# Altium project Shuttler_AMC.PrjPcb (part 15 of 20)

## Sheet IO_Connectors.SchDoc: =ProjectName
size 420 x 297 mm; Author: T.P.; CompanyName: WUT; DrawnBy: T.P.; Organization: WUT ISE; Address1: Warsaw Univeristy of Technology; Address2: Nowowiejska 15/19; DocumentNumber: 36; Revision: 0.9; SheetNumber: 36; SheetTotal: 36; EDA_Number: ARTIQ; Projet: ARTIQ/SINARA; ModifiedBy: -; CreateDate: XX/XX/XXXX; CheckedDate: -; Title2: IO_Connectors.SchDoc; DivGrp: ISE; Designer: G.K. and T.P.
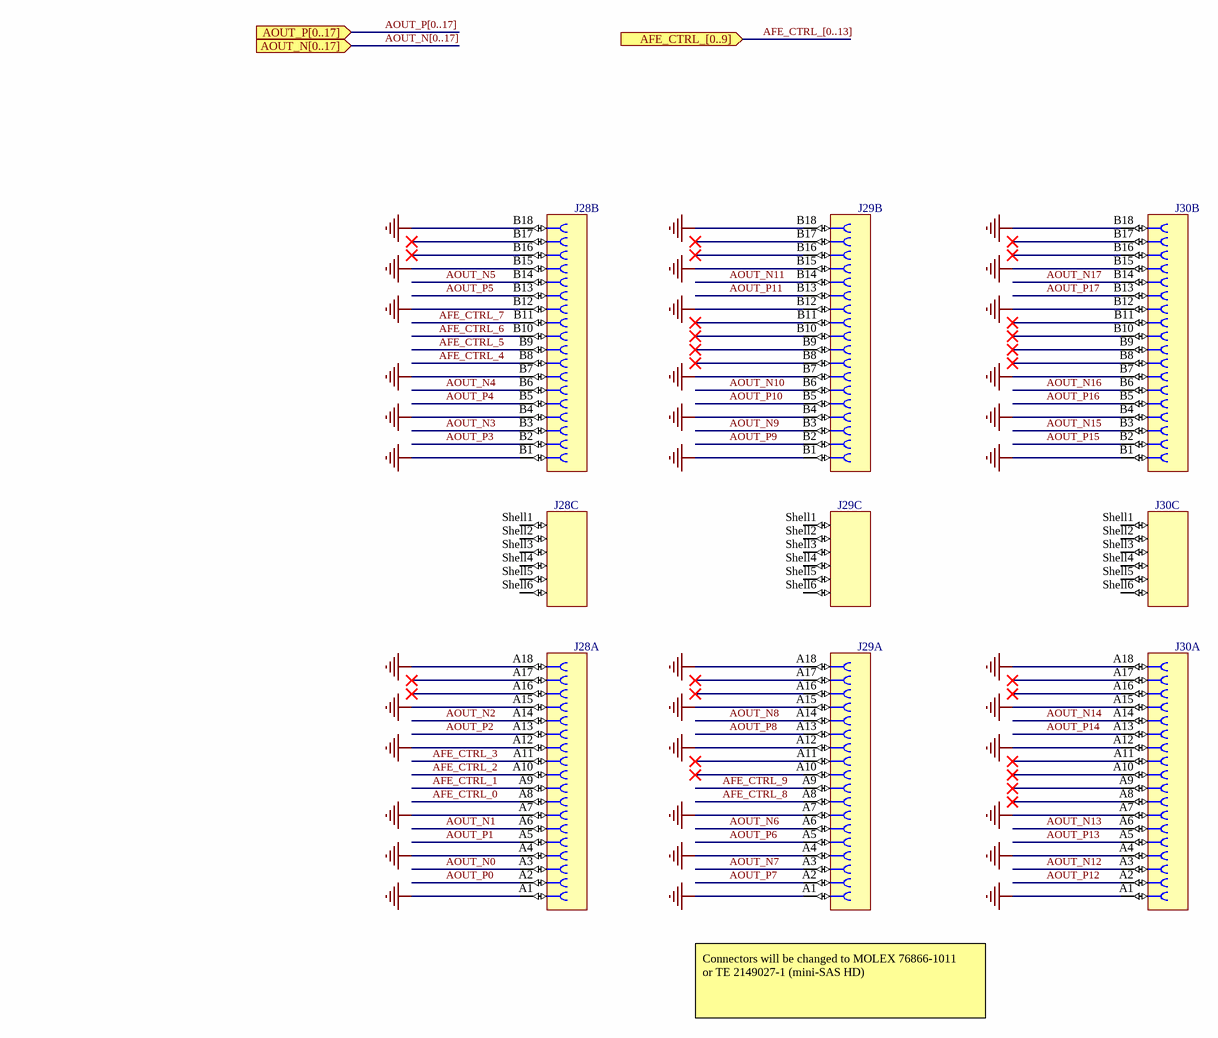
[diagram p26: IO_Connectors.SchDoc]

### Parts
J28  iPass™  [MOLEX_75783-0107]  (value not drawn)  (parts A,B,C of 3)
J29  iPass™  [MOLEX_75783-0107]  (value not drawn)  (parts A,B,C of 3)
J30  iPass™  [MOLEX_75783-0107]  (value not drawn)  (parts A,B,C of 3)

### Ports
AFE_CTRL_[0..9] (in), AOUT_N[0..17] (in), AOUT_P[0..17] (in)

### Nets
GND: J28.A1 J28.A4 J28.A7 J28.A12 J28.A15 J28.A18 J28.B1 J28.B4 J28.B7 J28.B12 J28.B15 J28.B18 J29.A1 J29.A4 J29.A7 J29.A12 J29.A15 J29.A18 J29.B1 J29.B4 J29.B7 J29.B12 J29.B15 J29.B18 J30.A1 J30.A4 J30.A7 J30.A12 J30.A15 J30.A18 J30.B1 J30.B4 J30.B7 J30.B12 J30.B15 J30.B18
AFE_CTRL_0: J28.A8
AFE_CTRL_1: J28.A9
AFE_CTRL_2: J28.A10
AFE_CTRL_3: J28.A11
AFE_CTRL_4: J28.B8
AFE_CTRL_5: J28.B9
AFE_CTRL_6: J28.B10
AFE_CTRL_7: J28.B11
AFE_CTRL_8: J29.A8
AFE_CTRL_9: J29.A9
AOUT_N0: J28.A3
AOUT_N1: J28.A6
AOUT_N2: J28.A14
AOUT_N3: J28.B3
AOUT_N4: J28.B6
AOUT_N5: J28.B14
AOUT_N6: J29.A6
AOUT_N7: J29.A3
AOUT_N8: J29.A14
AOUT_N9: J29.B3
AOUT_N10: J29.B6
AOUT_N11: J29.B14
AOUT_N12: J30.A3
AOUT_N13: J30.A6
AOUT_N14: J30.A14
AOUT_N15: J30.B3
AOUT_N16: J30.B6
AOUT_N17: J30.B14
AOUT_P0: J28.A2
AOUT_P1: J28.A5
AOUT_P2: J28.A13
AOUT_P3: J28.B2
AOUT_P4: J28.B5
AOUT_P5: J28.B13
AOUT_P6: J29.A5
AOUT_P7: J29.A2
AOUT_P8: J29.A13
AOUT_P9: J29.B2
AOUT_P10: J29.B5
AOUT_P11: J29.B13
AOUT_P12: J30.A2
AOUT_P13: J30.A5
AOUT_P14: J30.A13
AOUT_P15: J30.B2
AOUT_P16: J30.B5
AOUT_P17: J30.B13

Not connected (* = marked no-connect by the designer): J28 A16* A17* B16* B17* Shell1 Shell2 Shell3 Shell4 Shell5 Shell6; J29 A10* A11* A16* A17* B8* B9* B10* B11* B16* B17* Shell1 Shell2 Shell3 Shell4 Shell5 Shell6; J30 A8* A9* A10* A11* A16* A17* B8* B9* B10* B11* B16* B17* Shell1 Shell2 Shell3 Shell4 Shell5 Shell6

### Buses and harness runs
bus AFE_CTRL_[0..13] = port AFE_CTRL_[0..9]
bus AOUT_N[0..17] = port AOUT_N[0..17]
bus AOUT_P[0..17] = port AOUT_P[0..17]

### Notes on the sheet
- (near J29) Connectors will be changed to MOLEX 76866-1011
  or TE 2149027-1 (mini-SAS HD)
- Project/Equipment
- Document
- Designer
- Drawn by
- Check.by
- File
- Last Mod.
- Print Date
- Sheet
- Size
- A3
- of
- Rev

### Library data of the parts
J28-J30 = MOLEX_75783-0107: 36 Circuit, Right Angle , Internal Assembly, iPass™ I/O Surface Mount Receptacle with Left Key Shell; Manufacturer: MOLEX; PressFit: No; Part Number: MOLEX_75783-0107; Component Kind: Standard; Component Type: Standard; Pin Count: 42; Family: iPass™; Mounted: Yes; Socket: No; SMD: Yes; Sense: No; Status: None; Part Description: 36 Circuit, Right Angle , Internal Assembly, iPass™ I/O Surface Mount Receptacle with Left Key Shell; Manufacturer Part Number: 75783-0107; ComponentHeight: 8.47mm; HelpURL: \\cern.ch\dfs\Applications\Altium\Datasheets\MOLEX_75783-0107.pdf; Author: CERN DEM JLC; CreateDate: 12.11.2014; LatestRevisionDate: 12.11.2014

## Sheet FPGA_Bank_0_CFG.SchDoc: =ProjectName
size 420 x 297 mm; Author: T.P.; CompanyName: WUT; DrawnBy: T.P.; Organization: WUT ISE; Address1: Warsaw Univeristy of Technology; Address2: Nowowiejska 15/19; DocumentNumber: 4; Revision: 0.9; SheetNumber: 4; SheetTotal: 36; EDA_Number: ARTIQ; Projet: ARTIQ/SINARA; ModifiedBy: -; CreateDate: XX/XX/XXXX; CheckedDate: -; Title2: FPGA_Bank_0_CFG.SchDoc; DivGrp: ISE; Designer: G.K. and T.P.; ModifiedDate: -; ProjectName: ADC/DAC MEZZANINE
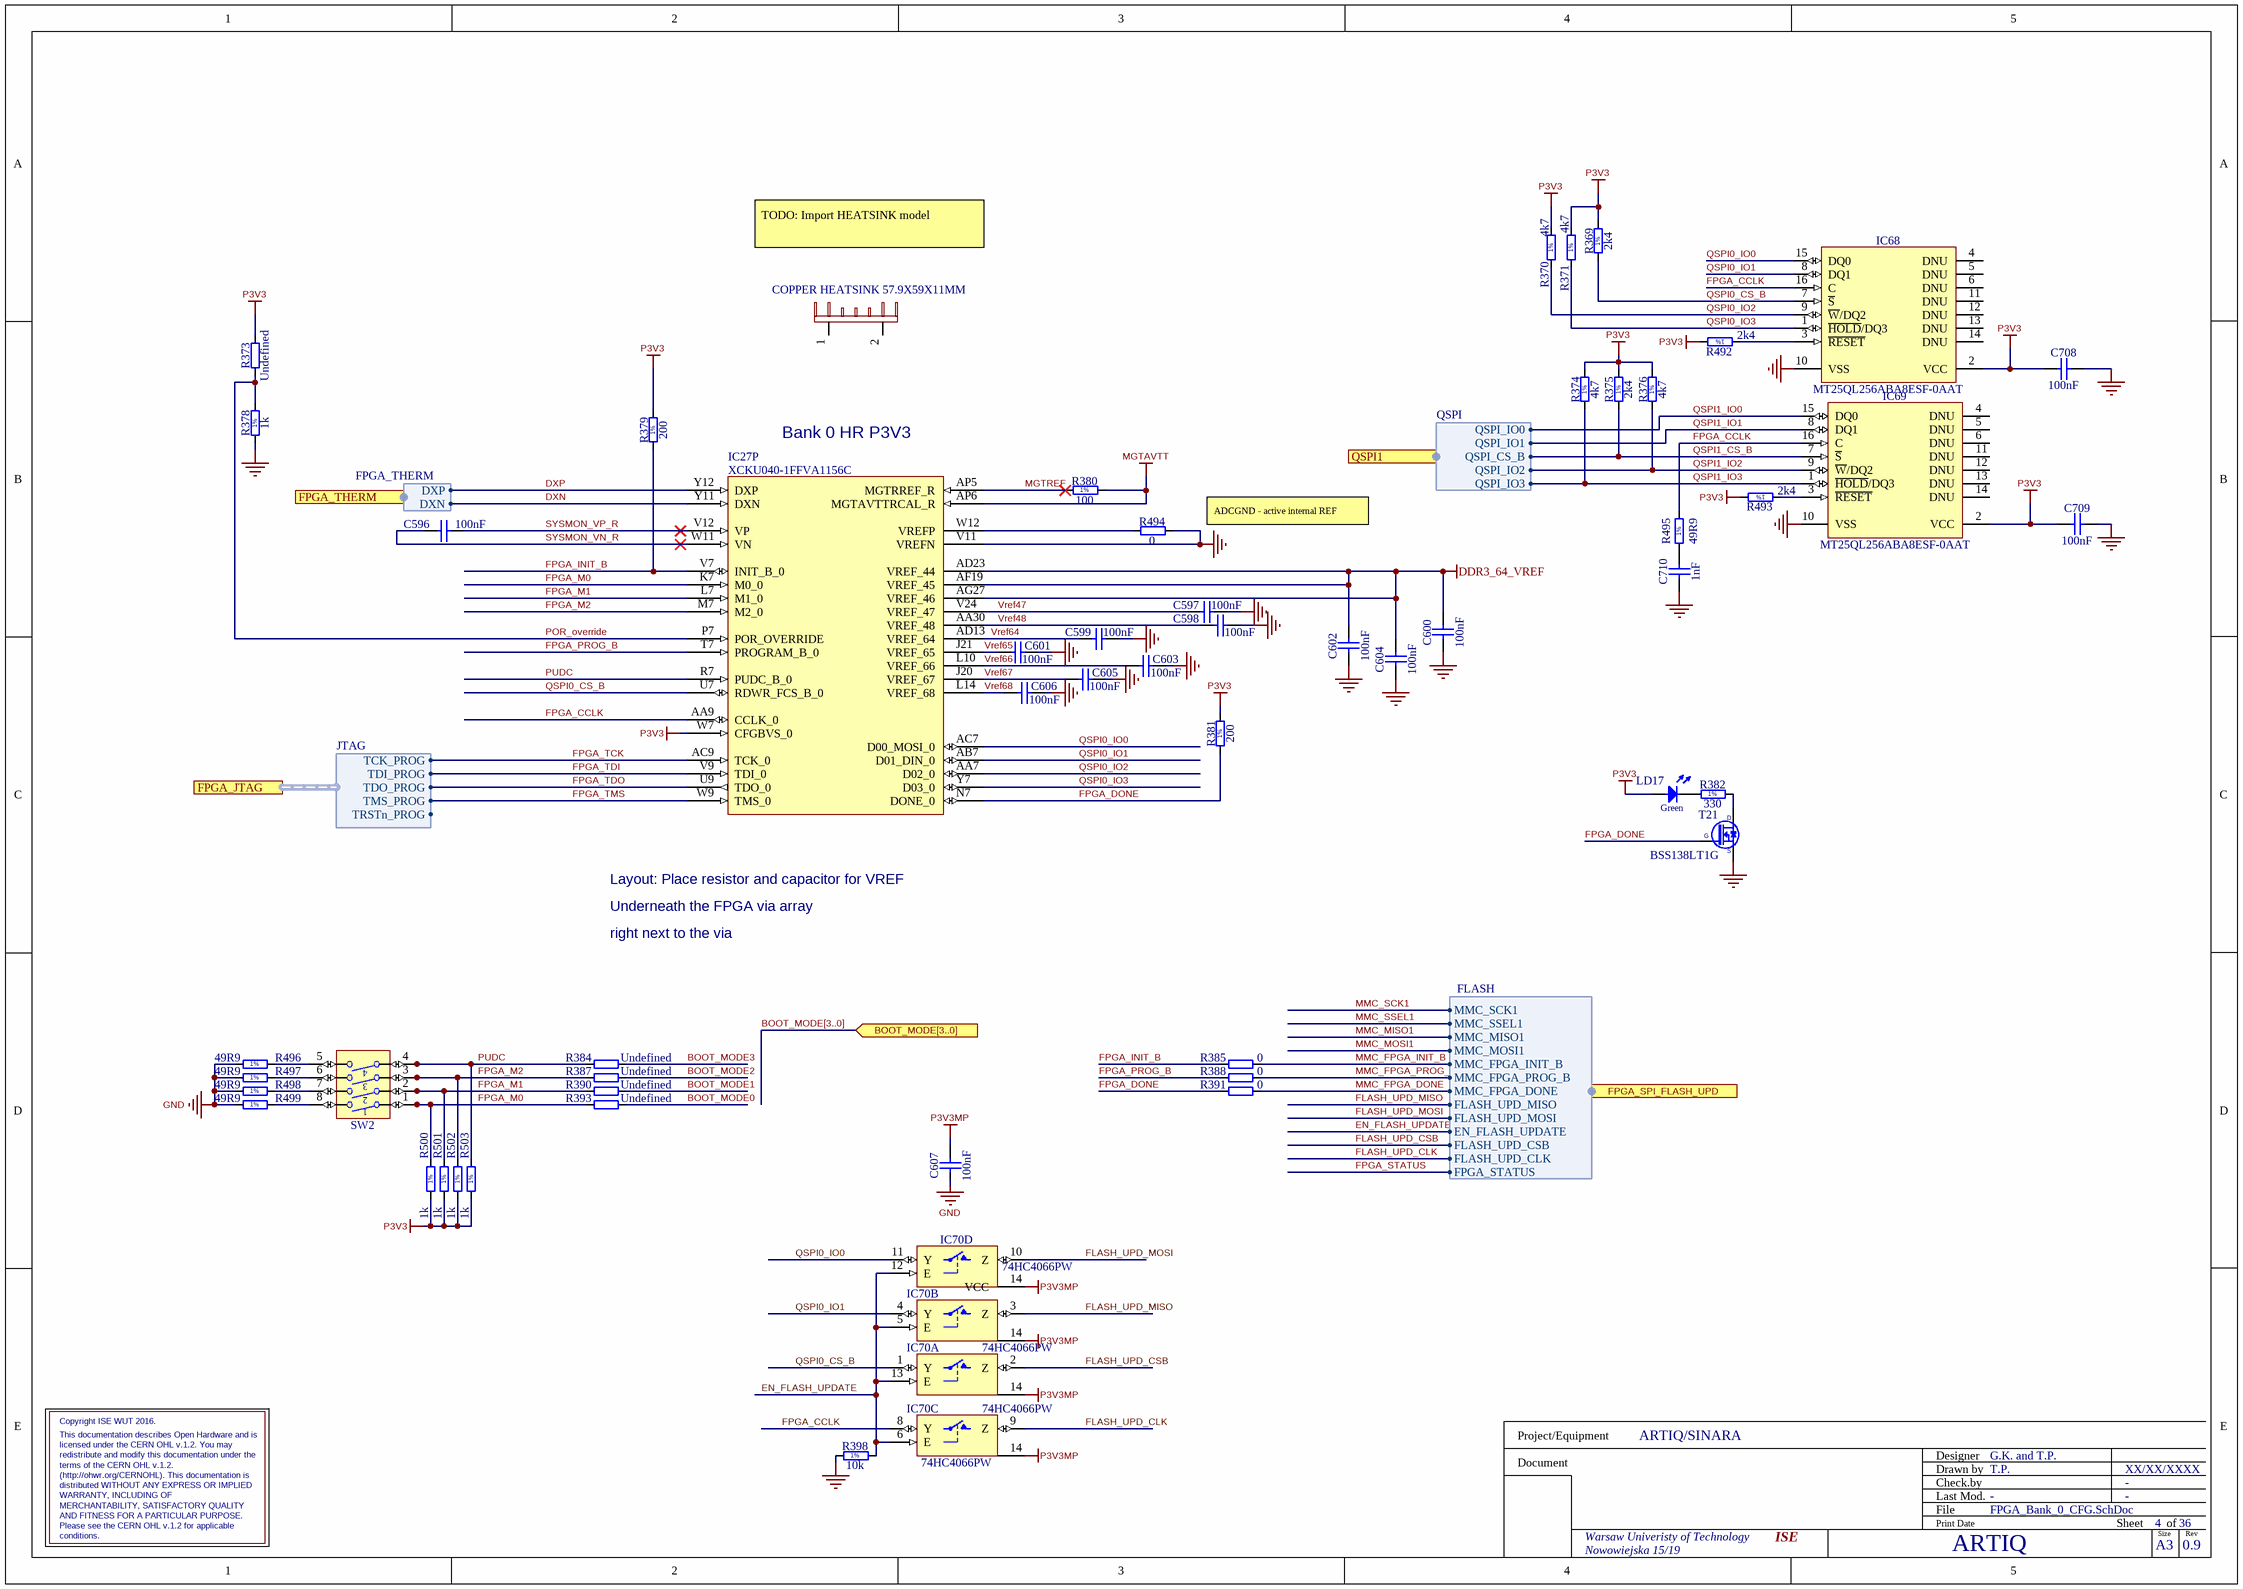
[diagram p27: FPGA_Bank_0_CFG.SchDoc]

### Parts
C596  100nF  [CAPC0603X33N]
C597  100nF  [CAPC0603X33N]
C598  100nF  [CAPC0603X33N]
C599  100nF  [CAPC0603X33N]
C600  100nF  [CAPC0603X33N]
C601  100nF  [CAPC0603X33N]
C602  100nF  [CAPC0603X33N]
C603  100nF  [CAPC0603X33N]
C604  100nF  [CAPC0603X33N]
C605  100nF  [CAPC0603X33N]
C606  100nF  [CAPC0603X33N]
C607  100nF  [CAPC0603X33N]
C708  100nF  [CAPC0603X33N]
C709  100nF  [CAPC0603X33N]
C710  1nF  [CAPC1005X55N]
HS1  Part Description: COPPER HEATSINK 57.9X59X11MM  (hidden comment: 1.9K/W)
IC27  XCKU040-1FFVA1156C  [BGA1156C100P34X34_3500X3500X350]  (part P of 22)
IC68  MT25QL256ABA8ESF-0AAT  [SOIC127P1030X265-16N]
IC69  MT25QL256ABA8ESF-0AAT  [SOIC127P1030X265-16N]
IC70  74HC4066PW  [SOP65P640X110-14N]  (parts A,B,C,D of 4)
LD17  Green  [LED_AVAGO_HSME-C120]
R369  2k4  [RESC1005X40N]
R370  4k7  [RESC1005X40N]
R371  4k7  [RESC1005X40N]
R373  Undefined  [RESC1005X40N]
R374  4k7  [RESC1005X40N]
R375  2k4  [RESC1005X40N]
R376  4k7  [RESC1005X40N]
R378  1k  [RESC1005X40N]
R379  200  [RESC1005X40N]
R380  100  [RESC0603X28N]
R381  200  [RESC1005X40N]
R382  330  [RESC1005X40N]
R384  Undefined  [RESC1005X40N]
R385  0  [RESC1005X40N]
R387  Undefined  [RESC1005X40N]
R388  0  [RESC1005X40N]
R390  Undefined  [RESC1005X40N]
R391  0  [RESC1005X40N]
R393  Undefined  [RESC1005X40N]
R398  10k  [RESC1005X40N]
R492  2k4  [RESC1005X40N]
R493  2k4  [RESC1005X40N]
R494  0  [RESC1005X40N]
R495  49R9  [RESC1005X40N]
R496  49R9  [RESC1005X40N]
R497  49R9  [RESC1005X40N]
R498  49R9  [RESC1005X40N]
R499  49R9  [RESC1005X40N]
R500  1k  [RESC1005X40N]
R501  1k  [RESC1005X40N]
R502  1k  [RESC1005X40N]
R503  1k  [RESC1005X40N]
SW2  Switch  [SW_TYCO_1571983-4]  (value not drawn)
T21  BSS138LT1G  [SOT95P240X110-3N]

### Ports
BOOT_MODE[3..0] (in), FPGA_JTAG (harness JTAG), FPGA_SPI_FLASH_UPD (harness FLASH), FPGA_THERM (harness FPGA_THERM), QSPI1 (harness QSPI)

### Harnesses
JTAG: TDO_PROG, TDI_PROG, TCK_PROG, TMS_PROG, TRSTn_PROG
FPGA_THERM: DXN, DXP
FLASH: MMC_SCK1, MMC_SSEL1, MMC_MISO1, MMC_MOSI1, MMC_FPGA_INIT_B, MMC_FPGA_PROG_B, MMC_FPGA_DONE, FLASH_UPD_MISO, FLASH_UPD_MOSI, EN_FLASH_UPDATE, FLASH_UPD_CSB, FLASH_UPD_CLK, FPGA_STATUS
QSPI: QSPI_IO1, QSPI_IO2, QSPI_IO3, QSPI_IO0, QSPI_CS_B

### Nets
DDR3_64_VREF: C600.1 C602.1 C604.1 IC27.AD23(VREF_44) IC27.AF19(VREF_45) IC27.AG27(VREF_46)
GND: C597.2 C598.2 C599.2 C600.2 C601.2 C602.2 C603.2 C604.2 C605.2 C606.2 C607.1 C708.1 C709.1 C710.1 IC27.V11(VREFN) IC68.10(VSS) IC69.10(VSS) IC70.7(GND) R378.1 R398.1 R494.2 R496.1 R497.1 R498.1 R499.1 T21.2(S)
MGTAVTT: IC27.AP6(MGTAVTTRCAL_R) R380.2
P3V3: C708.2 C709.2 IC27.W7(CFGBVS_0) IC68.2(VCC) IC69.2(VCC) LD17.2(A) R369.2 R370.2 R371.2 R373.2 R374.2 R375.2 R376.2 R379.2 R381.2 R492.2 R493.2 R500.1 R501.1 R502.1 R503.1
P3V3MP: C607.2 IC70.14(VCC)
BOOT_MODE0: R393.2
BOOT_MODE1: R390.2
BOOT_MODE2: R387.2
BOOT_MODE3: R384.2
DXN: IC27.Y11(DXN) ; port FPGA_THERM.DXN  [project net FPGA_THERM.DXN]
DXP: IC27.Y12(DXP) ; port FPGA_THERM.DXP  [project net FPGA_THERM.DXP]
EN_FLASH_UPDATE: IC70.5(E) IC70.6(E) IC70.12(E) IC70.13(E) R398.2 ; port FPGA_SPI_FLASH_UPD.EN_FLASH_UPDATE  [project net FPGA_SPI_FLASH_UPD.EN_FLASH_UPDATE]
FLASH_UPD_CLK: IC70.9(Z) ; port FPGA_SPI_FLASH_UPD.FLASH_UPD_CLK  [project net FPGA_SPI_FLASH_UPD.FLASH_UPD_CLK]
FLASH_UPD_CSB: IC70.2(Z) ; port FPGA_SPI_FLASH_UPD.FLASH_UPD_CSB  [project net FPGA_SPI_FLASH_UPD.FLASH_UPD_CSB]
FLASH_UPD_MISO: IC70.3(Z) ; port FPGA_SPI_FLASH_UPD.FLASH_UPD_MISO  [project net FPGA_SPI_FLASH_UPD.FLASH_UPD_MISO]
FLASH_UPD_MOSI: IC70.10(Z) ; port FPGA_SPI_FLASH_UPD.FLASH_UPD_MOSI  [project net FPGA_SPI_FLASH_UPD.FLASH_UPD_MOSI]
FPGA_CCLK: IC27.AA9(CCLK_0) IC68.16(C) IC69.16(C) IC70.8(Y) R495.2
FPGA_DONE: IC27.N7(DONE_0) R381.1 R391.1 T21.1(G)
FPGA_INIT_B: IC27.V7(INIT_B_0) R379.1 R385.1
FPGA_M0: IC27.K7(M0_0) R393.1 R500.2 SW2.1
FPGA_M1: IC27.L7(M1_0) R390.1 R501.2 SW2.2
FPGA_M2: IC27.M7(M2_0) R387.1 R502.2 SW2.3
FPGA_PROG_B: IC27.T7(PROGRAM_B_0) R388.1
FPGA_TCK: IC27.AC9(TCK_0) ; port FPGA_JTAG.TCK_PROG  [project net FPGA_JTAG.TCK_PROG]
FPGA_TDI: IC27.V9(TDI_0) ; port FPGA_JTAG.TDI_PROG  [project net FPGA_JTAG.TDI_PROG]
FPGA_TDO: IC27.U9(TDO_0) ; port FPGA_JTAG.TDO_PROG  [project net FPGA_JTAG.TDO_PROG]
FPGA_TMS: IC27.W9(TMS_0) ; port FPGA_JTAG.TMS_PROG  [project net FPGA_JTAG.TMS_PROG]
MGTREF: IC27.AP5(MGTRREF_R) R380.1
MMC_FPGA_DONE: R391.2 ; port FPGA_SPI_FLASH_UPD.MMC_FPGA_DONE  [project net FPGA_SPI_FLASH_UPD.MMC_FPGA_DONE]
MMC_FPGA_INIT_B: R385.2 ; port FPGA_SPI_FLASH_UPD.MMC_FPGA_INIT_B  [project net FPGA_SPI_FLASH_UPD.MMC_FPGA_INIT_B]
MMC_FPGA_PROG_B: R388.2 ; port FPGA_SPI_FLASH_UPD.MMC_FPGA_PROG_B  [project net FPGA_SPI_FLASH_UPD.MMC_FPGA_PROG_B]
POR_override: IC27.P7(POR_OVERRIDE) R373.1 R378.2
PUDC: IC27.R7(PUDC_B_0) R384.1 R503.2 SW2.4
QSPI0_CS_B: IC27.U7(RDWR_FCS_B_0) IC68.7(~{S}) IC70.1(Y) R369.1
QSPI0_IO0: IC27.AC7(D00_MOSI_0) IC68.15(DQ0) IC70.11(Y)
QSPI0_IO1: IC27.AB7(D01_DIN_0) IC68.8(DQ1) IC70.4(Y)
QSPI0_IO2: IC27.AA7(D02_0) IC68.9(~{W}/DQ2) R370.1
QSPI0_IO3: IC27.Y7(D03_0) IC68.1(~{HOLD}/DQ3) R371.1
QSPI1_CS_B: IC69.7(~{S}) R375.1 ; port QSPI1.QSPI_CS_B
QSPI1_IO0: IC69.15(DQ0) ; port QSPI1.QSPI_IO0
QSPI1_IO1: IC69.8(DQ1) ; port QSPI1.QSPI_IO1
QSPI1_IO2: IC69.9(~{W}/DQ2) R376.1 ; port QSPI1.QSPI_IO2
QSPI1_IO3: IC69.1(~{HOLD}/DQ3) R374.1 ; port QSPI1.QSPI_IO3
SYSMON_VN_R: C596.1 IC27.W11(VN)
SYSMON_VP_R: C596.2 IC27.V12(VP)
Vref47: C597.1 IC27.V24(VREF_47)
Vref48: C598.1 IC27.AA30(VREF_48)
Vref64: C599.1 IC27.AD13(VREF_64)
Vref65: C601.1 IC27.J21(VREF_65)
Vref66: C603.1 IC27.L10(VREF_66)
Vref67: C605.1 IC27.J20(VREF_67)
Vref68: C606.1 IC27.L14(VREF_68)
NetC710_2: C710.2 R495.1
NetIC27_W12: IC27.W12(VREFP) R494.1
NetIC68_3: IC68.3(~{RESET}) R492.1
NetIC69_3: IC69.3(~{RESET}) R493.1
NetLD17_1: LD17.1(C) R382.1
NetR382_2: R382.2 T21.3(D)
NetR496_2: R496.2 SW2.5
NetR497_2: R497.2 SW2.6
NetR498_2: R498.2 SW2.7
NetR499_2: R499.2 SW2.8

Not connected (* = marked no-connect by the designer): HS1 1(MOUNT1) 2(MOUNT2); IC68 4(DNU) 5(DNU) 6(DNU) 11(DNU) 12(DNU) 13(DNU) 14(DNU); IC69 4(DNU) 5(DNU) 6(DNU) 11(DNU) 12(DNU) 13(DNU) 14(DNU)

### Buses and harness runs
bus BOOT_MODE[3..0] = port BOOT_MODE[3..0]

### Notes on the sheet
- TODO: Import HEATSINK model
- (near IC27) Bank 0 HR P3V3
- (near R494) ADCGND - active internal REF
- Layout: Place resistor and capacitor for VREF
- right next to the via
- Underneath the FPGA via array
- terms of the CERN OHL v.1.2.
- (http://ohwr.org/CERNOHL). This documentation is
- redistribute and modify this documentation under the
- distributed WITHOUT ANY EXPRESS OR IMPLIED
- This documentation describes Open Hardware and is
- licensed under the CERN OHL v.1.2. You may
- Copyright ISE WUT 2016.
- AND FITNESS FOR A PARTICULAR PURPOSE.
- conditions.
- MERCHANTABILITY, SATISFACTORY QUALITY
- WARRANTY, INCLUDING OF
- Please see the CERN OHL v.1.2 for applicable
- Project/Equipment
- Document
- Designer
- Drawn by
- Check.by
- File
- Last Mod.
- Print Date
- Sheet
- Size
- A3
- of
- Rev
- (in symbol R0201_100R_1%_0.05W_200PPM) 1%
- (in symbol R0402_1K_1%_0.0625W_100PPM) 1%
- (in symbol R0402_2K4_1%_0.0625W_100PPM) 1%
- (in symbol R0402_4K7_1%_0.0625W_100PPM) 1%
- (in symbol R0402_10K_1%_0.0625W_100PPM) 1%
- (in symbol R0402_49R9_1%_0.0625W_100PPM) 1%
- (in symbol R0402_200R_1%_0.0625W_100PPM) 1%
- (in symbol R0402_330R_1%_0.0625W_100PPM) 1%

### Library data of the parts
C596-C606 C708 C709 = CC0201_100NF_6.3V_10%_X5R: Non-polarised capacitor; Manufacturer: GENERIC; Part Description: SMD Multilayer Chip Ceramic Capacitor; Manufacturer1 Part Number: 02016D104KAT2A; Tolerance: ±10%; Voltage: 6.3V; TC: X5R; Manufacturer Part Number: CC0201_100NF_6.3V_10%_X5R; Part Number: CC0201_100NF_6.3V_10%_X5R; Value: 100nF; Component Kind: Standard; Component Type: Standard; Pin Count: 2; Status: Not Recommended; Case: 0201; Mounted: Yes; Socket: No; SMD: Yes; Sense: No; Manufacturer1 Example: AVX; Manufacturer1 ComponentHeight: 0.33mm; HelpURL: \\cern.ch\dfs\Applications\Altium\Datasheets\CC0201_X5R_AVX.pdf; Author: CERN DEM JLC; CreateDate: 03.12.2007; LatestRevisionDate: 03.12.2007
C607 = CC0201_100NF_6.3V_10%_X5R: Non-polarised capacitor; Manufacturer: GENERIC; Manufacturer1 Part Number: 02016D104KAT2A; Part Description: SMD Multilayer Chip Ceramic Capacitor; TC: X5R; Tolerance: ±10%; Voltage: 6.3V; Author: CERN DEM JLC; Case: 0201; Component Kind: Standard; Component Type: Standard; CreateDate: 03.12.2007; HelpURL: \\cern.ch\dfs\Applications\Altium\Datasheets\CC0201_X5R_AVX.pdf; LatestRevisionDate: 03.12.2007; Manufacturer Part Number: CC0201_100NF_6.3V_10%_X5R; Manufacturer1 ComponentHeight: 0.33mm; Manufacturer1 Example: AVX; Mounted: Yes; Part Number: CC0201_100NF_6.3V_10%_X5R; Pin Count: 2; SMD: Yes; Socket: No; Status: Not Recommended; Value: 100nF; Sense: No
C710 = CC0402_1NF_50V_10%_X7R: Non-polarised capacitor; Manufacturer: GENERIC; Part Description: SMD Multilayer Chip Ceramic Capacitor; Manufacturer1 Part Number: 223858715623; Tolerance: ±10%; Voltage: 50V; TC: X7R; Manufacturer Part Number: CC0402_1NF_50V_10%_X7R; Part Number: CC0402_1NF_50V_10%_X7R; Value: 1nF; Component Kind: Standard; Component Type: Standard; Pin Count: 2; Status: Not Recommended; Case: 0402; Mounted: Yes; Socket: No; SMD: Yes; Sense: No; Manufacturer1 Example: PHYCOMP; Manufacturer1 ComponentHeight: 0.55mm; HelpURL: \\cern.ch\dfs\Applications\Altium\Datasheets\CC0402_X7R_PHYCOMP.pdf; Author: CERN DEM JLC; CreateDate: 03.12.2007; LatestRevisionDate: 03.12.2007
HS1 = HSINK_AAVID_342947: Manufacturer: Aavid Thermalloy; $$Internal_Resolution: 00001mm; $$NotCommonProperty_Device: 342947; Cell Name: HS_AAVID_342947; CmpIndex: 1139; DXDB_LIBNAME: MISC_GK; Ref Designator: HS1; SymIndex: 1784; $$Internal___BlkDate: 23:37:56_12-26-16; Footprint: HS_AAVID_342947; Manufacturer Part Number: 342947; Part Name: HSINK_AAVID_342947; Part Number: HSINK_AAVID_342947; Value: 1.9K/W; Orientation: 0 = 0
IC27 = XCKU040-1FFVA1156C: Kintex UltraScale FPGA, 520 I/O, 530K Cells, 1156-Ball BGA, Speed Grade 1, Commercial Grade; Manufacturer: XILINX; Part Description: Kintex UltraScale, 40 DLL I/O, 416 HP I/O, 104 HR I/O, 1156-Pin BGA, Speed Grade 1, Commercial Grade; PressFit: No; Bonding: No; Manufacturer Part Number: XCKU040-1FFVA1156C; PackageDescription: BGA, 1.00mm Pitch, Square; 1156 Pin, 34 Columns X 34 Rows, Body 35.00mm X 35.00mm X 3.50mm H, IPC Medium Density; Part Number: XCKU040-1FFVA1156C; Component Kind: Standard; Component Type: Standard; Device: XCKU040-1FFVA1156C; Pin Count: 1156; Case: BGA1156; Mounted: Yes; Socket: No; SMD: Yes; Sense: No; ComponentHeight: 3.5mm; HelpURL: \\cern.ch\dfs\Applications\Altium\Datasheets\XCKU040-1FFVA1156C.pdf; ComponentLink1URL: \\cern.ch\dfs\Applications\Altium\Datasheets\XCKU040-1FFVA1156C_Package-Pinout.pdf; ComponentLink1Description: Package/Pinout; Author: CERN DEM CA; CreateDate: 16.08.2016; LatestRevisionDate: 16.08.2016
IC68 IC69 = MT25QL256ABA8ESF-0AAT: 256Mbit (32MB), 2.7V-3.6V, Multiple I/O Serial NOR Flash Memory,with Reset# & Hold#; Part Description: 256Mbit (32MB), 2.7V-3.6V, Multiple I/O Serial NOR Flash Memory,with Reset# & Hold# (Automotive grade AEC-Q100); Manufacturer: MICRON TECHNOLOGY; PressFit: No; Bonding: No; Part Number: MT25QL256ABA8ESF-0AAT; Component Kind: Standard; Component Type: Standard; Device: MT25QL256ABA8ESF-0AAT; PackageDescription: SOIC 16, Pitch 1.27mm - Body 7.5x10.3mm, IPC Medium Density; Manufacturer Part Number: MT25QL256ABA8ESF-0AAT; Pin Count: 16; Case: SOIC16; Mounted: Yes; Socket: No; SMD: Yes; Sense: No; ComponentHeight: 2.65mm; HelpURL: \\cern.ch\dfs\Applications\Altium\Datasheets\MT25QL256ABA8ESF-0AAT.pdf; Author: CERN DEM JLC; CreateDate: 05.11.2018; LatestRevisionDate: 05.11.2018
IC70 = 74HC4066PW: Manufacturer: NXP SEMICONDUCTORS; Part Description: Quad Single-Pole Single-Throw Analog Switch; PressFit: No; Bonding: No; Manufacturer Part Number: 74HC4066PW; PackageDescription: SOP, 14-Leads, Body 4.4x5mm (max), Pitch 0.65mm, IPC Medium Density; Part Number: 74HC4066PW; Component Kind: Standard; Component Type: Standard; Device: 74HC4066PW; Pin Count: 14; Case: TSSOP14; Mounted: Yes; Socket: No; SMD: Yes; Sense: No; ComponentHeight: 1.1mm; Author: CERN DEM JLC; HelpURL: \\cern.ch\dfs\Applications\Altium\Datasheets\74HC4066PW.pdf; CreateDate: 19.11.2014; LatestRevisionDate: 19.11.2014
LD17 = LED_AVAGO_HSME-C120: LED Green 1C 2A; Manufacturer: AVAGO TECHNOLOGIES; Part Description: High Performance Right Angle Chip Green LED; PressFit: No; Bonding: No; Manufacturer Part Number: HSME-C120; PackageDescription: Green Chip LED, 2-Leads, Body 1.7x1.1mm, Side Emitting Package; Part Number: LED_AVAGO_HSME-C120; Component Kind: Standard; Component Type: Standard; Color: Green; Pin Count: 2; Mounted: Yes; Socket: No; SMD: Yes; Sense: No; ComponentHeight: 0.7mm; HelpURL: \\cern.ch\dfs\Applications\Altium\Datasheets\LED_AVAGO_HSME-C120.pdf; ComponentLink1URL: \\cern.ch\dfs\Applications\Altium\Datasheets\LED_AVAGO_HSME-C110_DESIGN-GUIDE.pdf; ComponentLink1Description: Design Guide; Author: CERN DEM JMW; CreateDate: 22.07.2009; LatestRevisionDate: 20.06.2012
R369 R375 R492 R493 = R0402_2K4_1%_0.0625W_100PPM: Resistor - 1%; Manufacturer: GENERIC; Part Description: General Purpose Thick Film Chip Resistor; Manufacturer1 Part Number: 232270672402L; TC: ±100ppm/°C; PressFit: No; Manufacturer Part Number: R0402_2K4_1%_0.0625W_100PPM; Part Number: R0402_2K4_1%_0.0625W_100PPM; Tolerance: ±1%; Value: 2k4; Component Kind: Standard; Component Type: Standard; Pin Count: 2; Status: Not Recommended; Power: 0.0625W; Case: 0402; Mounted: Yes; Sense: No; Socket: No; SMD: Yes; Manufacturer1 Example: YAGEO PHYCOMP; Manufacturer1 ComponentHeight: 0.4mm; HelpURL: \\cern.ch\dfs\Applications\Altium\Datasheets\R0402_Phycomp_RC0402.pdf; Author: CERN DEM JLC; CreateDate: 03.12.2007; LatestRevisionDate: 17.10.2012
R370 R371 R374 R376 = R0402_4K7_1%_0.0625W_100PPM: Resistor - 1%; Manufacturer: GENERIC; Part Description: General Purpose Thick Film Chip Resistor; Manufacturer1 Part Number: 232270674702L; TC: ±100ppm/°C; PressFit: No; Manufacturer Part Number: R0402_4K7_1%_0.0625W_100PPM; Part Number: R0402_4K7_1%_0.0625W_100PPM; Tolerance: ±1%; Value: 4k7; Component Kind: Standard; Component Type: Standard; Pin Count: 2; Status: Not Recommended; Power: 0.0625W; Case: 0402; Mounted: Yes; Sense: No; Socket: No; SMD: Yes; Manufacturer1 Example: YAGEO PHYCOMP; Manufacturer1 ComponentHeight: 0.4mm; HelpURL: \\cern.ch\dfs\Applications\Altium\Datasheets\R0402_Phycomp_RC0402.pdf; Author: CERN DEM JLC; CreateDate: 03.12.2007; LatestRevisionDate: 17.10.2012
R373 R384 R387 R390 R393 = R0402_NO-VALUE: Resistor; Part Description: Reserved Footprint For a 0402 (1005) Chip Resistor; PressFit: No; Mounted: No; Manufacturer Part Number: R0402_NO-VALUE; Manufacturer: Undefined; Part Number: R0402_NO-VALUE; Value: Undefined; Component Kind: Standard; Component Type: Standard; Pin Count: 2; Status: None; Case: 0402; Sense: No; Socket: No; SMD: Yes; Manufacturer1 Example: Undefined; Manufacturer1 Part Number: Undefined; Manufacturer1 ComponentHeight: Undefined; HelpURL: Undefined; Author: CERN DEM JLC; CreateDate: 03.12.2007; LatestRevisionDate: 13.03.2008
R378 R500-R503 = R0402_1K_1%_0.0625W_100PPM: Resistor - 1%; Manufacturer: GENERIC; Part Description: General Purpose Thick Film Chip Resistor; Manufacturer1 Part Number: 232270671002L; TC: ±100ppm/°C; PressFit: No; Manufacturer Part Number: R0402_1K_1%_0.0625W_100PPM; Part Number: R0402_1K_1%_0.0625W_100PPM; Tolerance: ±1%; Value: 1k; Component Kind: Standard; Component Type: Standard; Pin Count: 2; Status: Not Recommended; Power: 0.0625W; Case: 0402; Mounted: Yes; Sense: No; Socket: No; SMD: Yes; Manufacturer1 Example: YAGEO PHYCOMP; Manufacturer1 ComponentHeight: 0.4mm; HelpURL: \\cern.ch\dfs\Applications\Altium\Datasheets\R0402_Phycomp_RC0402.pdf; Author: CERN DEM JLC; CreateDate: 03.12.2007; LatestRevisionDate: 17.10.2012
R379 R381 = R0402_200R_1%_0.0625W_100PPM: Resistor - 1%; Manufacturer: GENERIC; Part Description: General Purpose Thick Film Chip Resistor; Manufacturer1 Part Number: 232270672001L; TC: ±100ppm/°C; PressFit: No; Manufacturer Part Number: R0402_200R_1%_0.0625W_100PPM; Part Number: R0402_200R_1%_0.0625W_100PPM; Tolerance: ±1%; Value: 200; Component Kind: Standard; Component Type: Standard; Pin Count: 2; Status: Not Recommended; Power: 0.0625W; Case: 0402; Mounted: Yes; Sense: No; Socket: No; SMD: Yes; Manufacturer1 Example: YAGEO PHYCOMP; Manufacturer1 ComponentHeight: 0.4mm; HelpURL: \\cern.ch\dfs\Applications\Altium\Datasheets\R0402_Phycomp_RC0402.pdf; Author: CERN DEM JLC; CreateDate: 03.12.2007; LatestRevisionDate: 17.10.2012
R380 = R0201_100R_1%_0.05W_200PPM: Resistor - 1%; Manufacturer: GENERIC; Part Description: Thick Film Chip Resistor; Manufacturer1 Part Number: CRCW0201100RFNED; Power: 0.05W; TC: ±200ppm/°C; PressFit: No; Manufacturer Part Number: R0201_100R_1%_0.05W_200PPM; Part Number: R0201_100R_1%_0.05W_200PPM; Tolerance: ±1%; Value: 100; Component Kind: Standard; Component Type: Standard; Pin Count: 2; Status: Not Recommended; Case: 0201; Mounted: Yes; Sense: No; Socket: No; SMD: Yes; Manufacturer1 Example: VISHAY; Manufacturer1 ComponentHeight: 0.27mm; HelpURL: \\cern.ch\dfs\Applications\Altium\Datasheets\R0201_VISHAY_CRCW e3.pdf; Author: CERN DEM JLC; CreateDate: 13.11.2014; LatestRevisionDate: 13.11.2014
R382 = R0402_330R_1%_0.0625W_100PPM: Resistor - 1%; Manufacturer: GENERIC; Part Description: General Purpose Thick Film Chip Resistor; Manufacturer1 Part Number: 232270673301L; TC: ±100ppm/°C; PressFit: No; Manufacturer Part Number: R0402_330R_1%_0.0625W_100PPM; Part Number: R0402_330R_1%_0.0625W_100PPM; Tolerance: ±1%; Value: 330; Component Kind: Standard; Component Type: Standard; Pin Count: 2; Status: Not Recommended; Power: 0.0625W; Case: 0402; Mounted: Yes; Sense: No; Socket: No; SMD: Yes; Manufacturer1 Example: YAGEO PHYCOMP; Manufacturer1 ComponentHeight: 0.4mm; HelpURL: \\cern.ch\dfs\Applications\Altium\Datasheets\R0402_Phycomp_RC0402.pdf; Author: CERN DEM JLC; CreateDate: 03.12.2007; LatestRevisionDate: 17.10.2012
R385 R388 R391 R494 = R0402_0R_JUMPER: Resistor; Manufacturer: GENERIC; Part Description: 1A (0.05R Max DC Resistance) Zero Ohm Jumper; Manufacturer1 Part Number: 232270591001L; PressFit: No; Manufacturer Part Number: R0402_0R_JUMPER; Part Number: R0402_0R_JUMPER; Value: 0; Component Kind: Standard; Component Type: Standard; Pin Count: 2; Status: Not Recommended; Case: 0402; Mounted: Yes; Sense: No; Socket: No; SMD: Yes; Manufacturer1 Example: YAGEO PHYCOMP; Manufacturer1 ComponentHeight: 0.4mm; HelpURL: \\cern.ch\dfs\Applications\Altium\Datasheets\R0402_Phycomp_RC0402.pdf; Author: CERN DEM JLC; CreateDate: 03.12.2007; LatestRevisionDate: 17.10.2012
R398 = R0402_10K_1%_0.0625W_100PPM: Resistor - 1%; Manufacturer: GENERIC; Part Description: General Purpose Thick Film Chip Resistor; Manufacturer1 Part Number: 232270671003L; TC: ±100ppm/°C; PressFit: No; Manufacturer Part Number: R0402_10K_1%_0.0625W_100PPM; Part Number: R0402_10K_1%_0.0625W_100PPM; Tolerance: ±1%; Value: 10k; Component Kind: Standard; Component Type: Standard; Pin Count: 2; Status: Not Recommended; Power: 0.0625W; Case: 0402; Mounted: Yes; Sense: No; Socket: No; SMD: Yes; Manufacturer1 Example: YAGEO PHYCOMP; Manufacturer1 ComponentHeight: 0.4mm; HelpURL: \\cern.ch\dfs\Applications\Altium\Datasheets\R0402_Phycomp_RC0402.pdf; Author: CERN DEM JLC; CreateDate: 03.12.2007; LatestRevisionDate: 17.10.2012
R495-R499 = R0402_49R9_1%_0.0625W_100PPM: Resistor - 1%; Manufacturer: GENERIC; Part Description: General Purpose Thick Film Chip Resistor; Manufacturer1 Part Number: 232270674999L or RC0402FR-0749R9L; TC: ±100ppm/°C; PressFit: No; Manufacturer Part Number: R0402_49R9_1%_0.0625W_100PPM; Part Number: R0402_49R9_1%_0.0625W_100PPM; Tolerance: ±1%; Value: 49R9; Component Kind: Standard; Component Type: Standard; Pin Count: 2; Status: Not Recommended; Power: 0.0625W; Case: 0402; Mounted: Yes; Sense: No; Socket: No; SMD: Yes; Manufacturer1 Example: YAGEO PHYCOMP; Manufacturer1 ComponentHeight: 0.4mm; HelpURL: \\cern.ch\dfs\Applications\Altium\Datasheets\R0402_Phycomp_RC0402.pdf; Author: CERN DEM JLC; CreateDate: 24.10.2012; LatestRevisionDate: 24.10.2012
SW2 = SW_TYCO_1571983-4: 4 Ways SPST DIP Switch; Manufacturer Part Number: 1571983-4 or GDH04S04; Manufacturer: TYCO; Part Description: 4 Way SPST SMD DIP Switch, Latched, Contact Rating 0.025A 24VDC; PressFit: No; PackageDescription: Pitch 1.27mm,  Body 6.2x6.2mm, 4 Ways SPST Surface-Mount DIP Switch, TYCO GDH Series; Part Number: SW_TYCO_1571983-4; Component Kind: Standard; Component Type: Standard; Pin Count: 8; Family: Switch; Mounted: Yes; Socket: No; SMD: Yes; Sense: No; Status: None; ComponentHeight: 2.31mm; HelpURL: \\cern.ch\dfs\Applications\Altium\Datasheets\SW_TYCO_1571983-4.pdf; Author: CERN DEM JLC; CreateDate: 08.01.2009; LatestRevisionDate: 08.01.2009
T21 = BSS138LT1G: N-CHANNEL MOSFET WITH DIODE; Manufacturer: ON SEMICONDUCTOR; Part Description: 50V 200mA N-Channel Enhancement Mode Field-Effect Transistor; PressFit: No; Bonding: No; Manufacturer Part Number: BSS138LT1G; PackageDescription: SOT23 3-Leads, Pitch 0.95mm - Body 1.4x3mm, IPC Medium Density; Part Number: BSS138LT1G; Component Kind: Standard; Component Type: Standard; Device: BSS138LT1G; Pin Count: 3; Case: SOT23-3; Mounted: Yes; Socket: No; SMD: Yes; Sense: No; ComponentHeight: 1.11mm; HelpURL: \\cern.ch\dfs\Applications\Altium\Datasheets\BSS138LT1G.pdf; Author: CERN DEM JLC; CreateDate: 23.03.2009; LatestRevisionDate: 23.03.2009

## Sheet FPGA_Banks_GTH.SchDoc: =ProjectName
size 420 x 297 mm; Author: T.P.; CompanyName: WUT; DrawnBy: T.P.; Organization: WUT ISE; Address1: Warsaw Univeristy of Technology; Address2: Nowowiejska 15/19; DocumentNumber: 10; Revision: 0.9; SheetNumber: 10; SheetTotal: 36; EDA_Number: ARTIQ; Projet: ARTIQ/SINARA; ModifiedBy: -; CreateDate: XX/XX/XXXX; CheckedDate: -; Title2: FPGA_Banks_GTH.SchDoc; DivGrp: ISE; Designer: G.K. and T.P.; ModifiedDate: -; ProjectName: ADC/DAC MEZZANINE
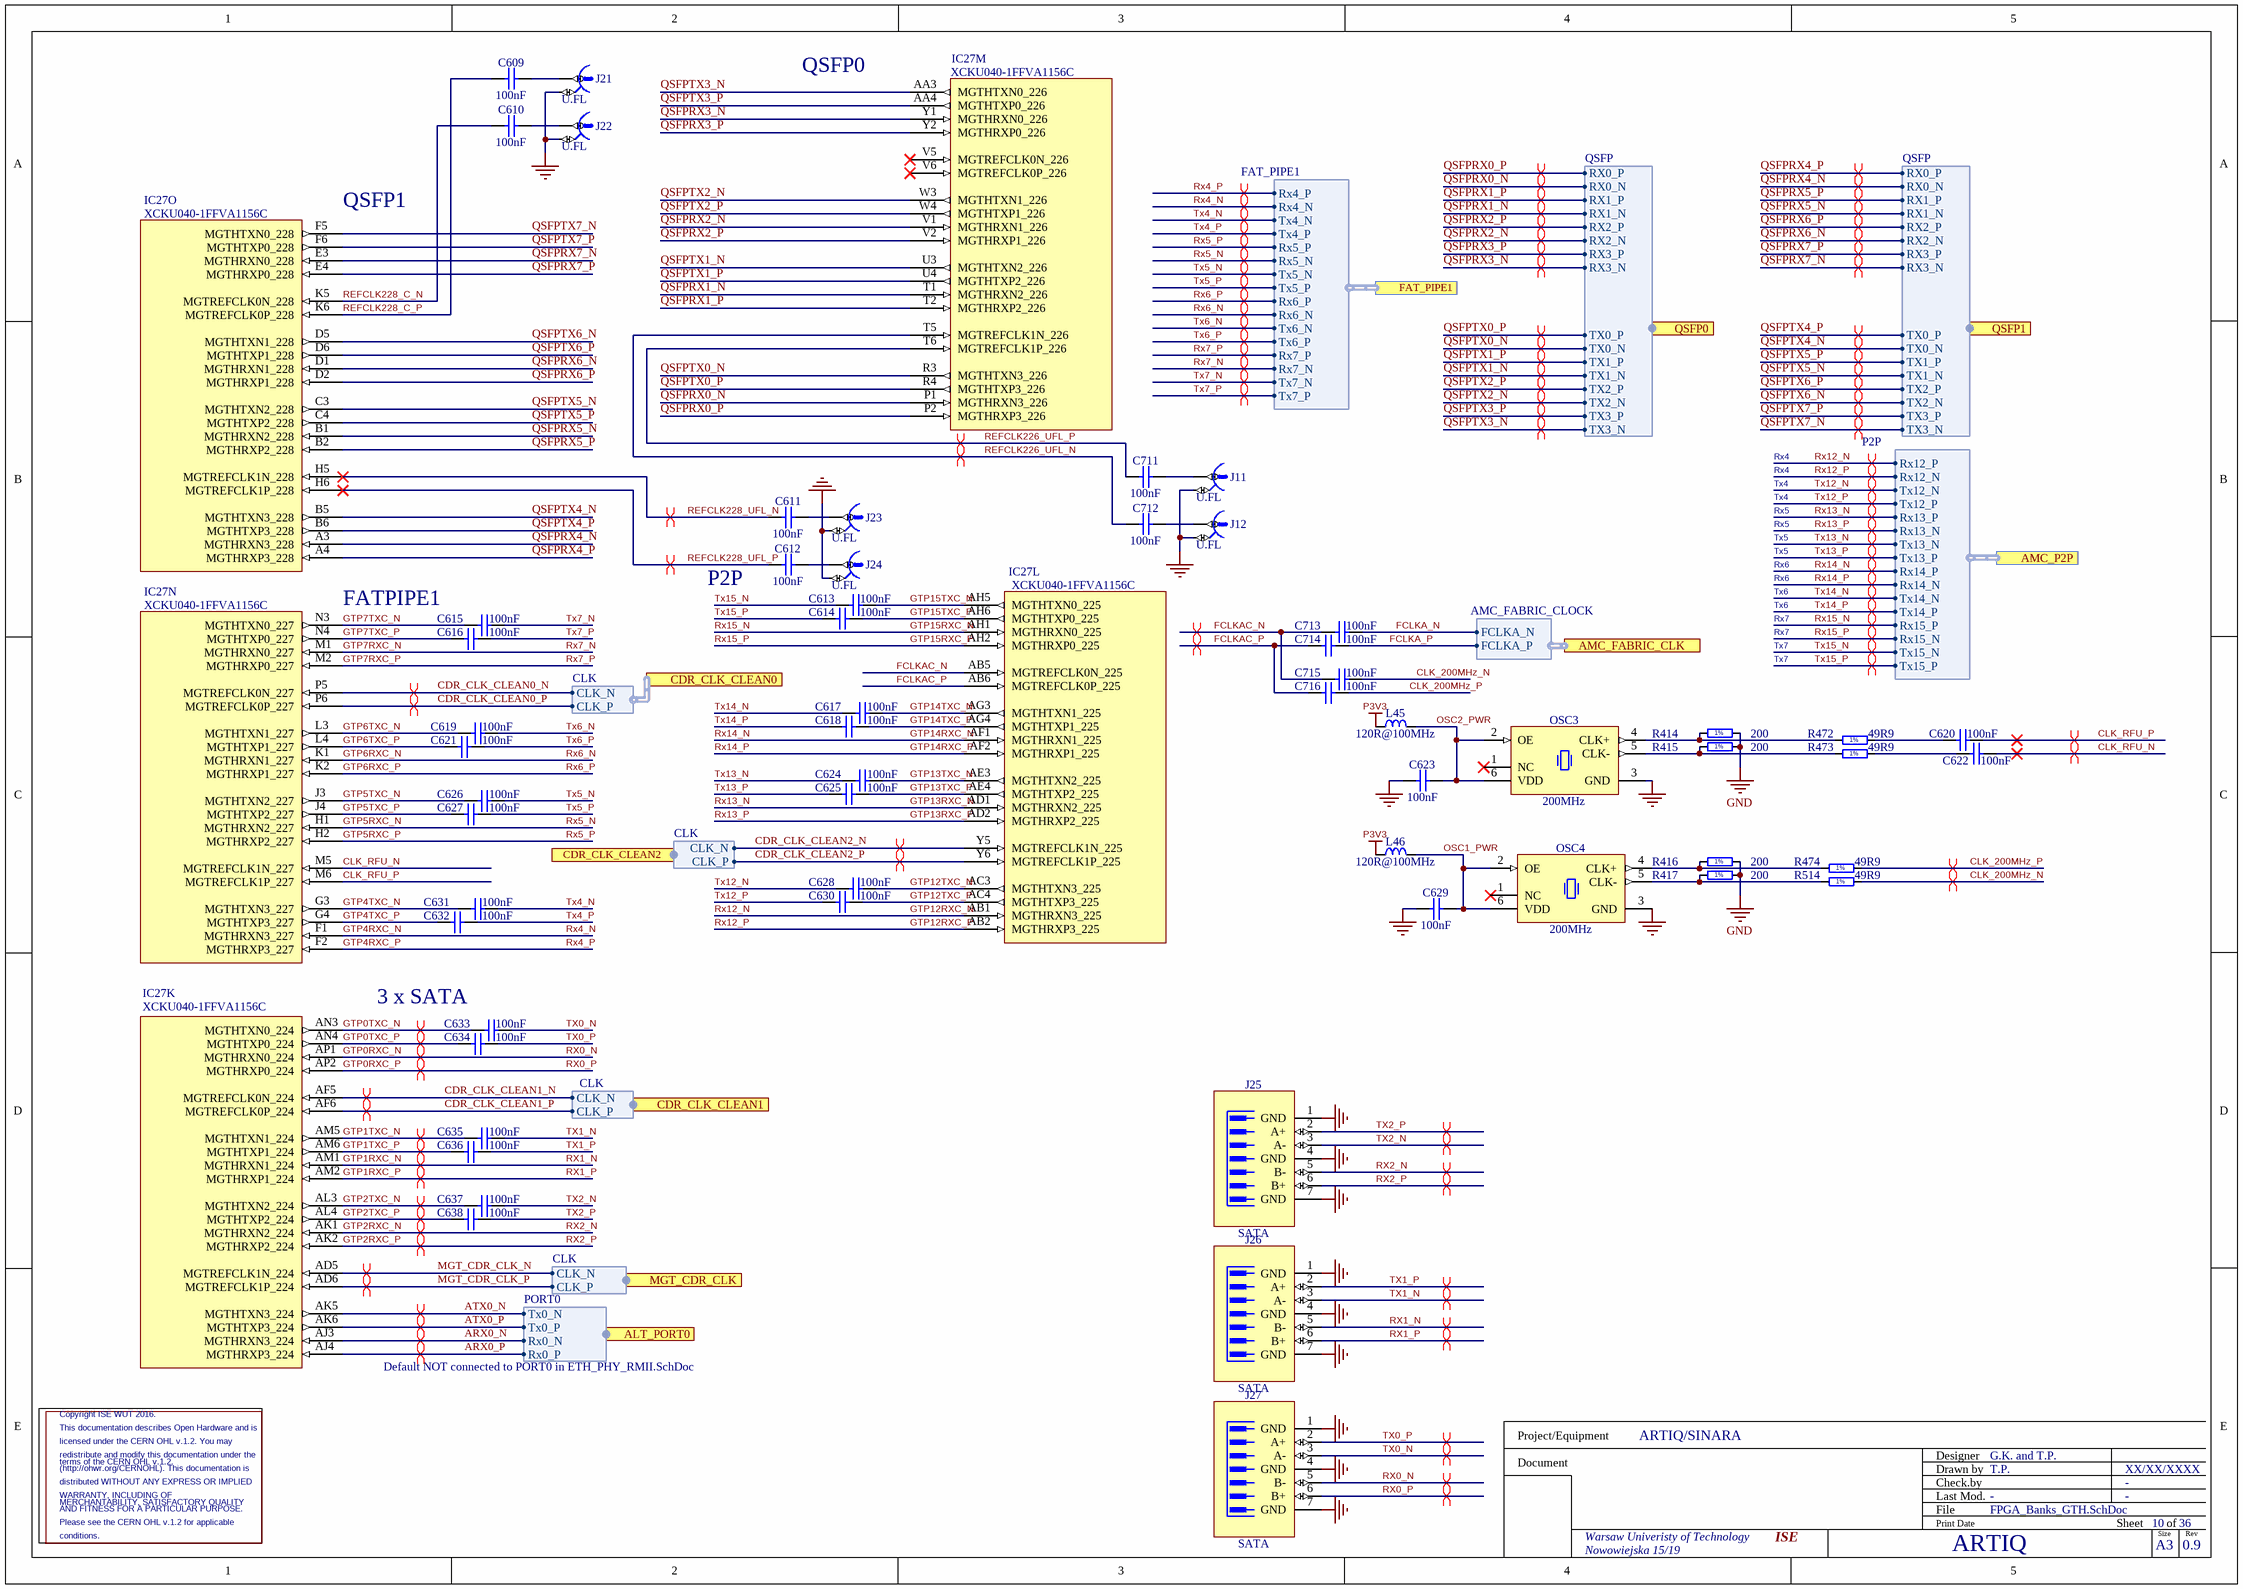
[diagram p28: FPGA_Banks_GTH.SchDoc]

### Parts
C609  100nF  [CAPC0603X33N]
C610  100nF  [CAPC0603X33N]
C611  100nF  [CAPC0603X33N]
C612  100nF  [CAPC0603X33N]
C613  100nF  [CAPC0603X33N]
C614  100nF  [CAPC0603X33N]
C615  100nF  [CAPC0603X33N]
C616  100nF  [CAPC0603X33N]
C617  100nF  [CAPC0603X33N]
C618  100nF  [CAPC0603X33N]
C619  100nF  [CAPC0603X33N]
C620  100nF  [CAPC0603X33N]
C621  100nF  [CAPC0603X33N]
C622  100nF  [CAPC0603X33N]
C623  100nF  [CAPC0603X33N]
C624  100nF  [CAPC0603X33N]
C625  100nF  [CAPC0603X33N]
C626  100nF  [CAPC0603X33N]
C627  100nF  [CAPC0603X33N]
C628  100nF  [CAPC0603X33N]
C629  100nF  [CAPC0603X33N]
C630  100nF  [CAPC0603X33N]
C631  100nF  [CAPC0603X33N]
C632  100nF  [CAPC0603X33N]
C633  100nF  [CAPC0603X33N]
C634  100nF  [CAPC0603X33N]
C635  100nF  [CAPC0603X33N]
C636  100nF  [CAPC0603X33N]
C637  100nF  [CAPC0603X33N]
C638  100nF  [CAPC0603X33N]
C711  100nF  [CAPC0603X33N]
C712  100nF  [CAPC0603X33N]
C713  100nF  [CAPC0603X33N]
C714  100nF  [CAPC0603X33N]
C715  100nF  [CAPC0603X33N]
C716  100nF  [CAPC0603X33N]
IC27  XCKU040-1FFVA1156C  [BGA1156C100P34X34_3500X3500X350]  (parts K,L,M,N,O of 22)
J11  U.FL  [HIROSE_U.FL-R-SMT-1(10)]
J12  U.FL  [HIROSE_U.FL-R-SMT-1(10)]
J21  U.FL  [HIROSE_U.FL-R-SMT-1(10)]
J22  U.FL  [HIROSE_U.FL-R-SMT-1(10)]
J23  U.FL  [HIROSE_U.FL-R-SMT-1(10)]
J24  U.FL  [HIROSE_U.FL-R-SMT-1(10)]
J25  SATA  [MOLEX_67800-5005]
J26  SATA  [MOLEX_67800-5005]
J27  SATA  [MOLEX_67800-5005]
L45  120R@100MHz  [INDC1005X55N]
L46  120R@100MHz  [INDC1005X55N]
OSC3  200MHz  [OSC_SILICON-LAB_SI510-6N(5X7)]
OSC4  200MHz  [OSC_SILICON-LAB_SI510-6N(5X7)]
R414  200  [RESC1005X40N]
R415  200  [RESC1005X40N]
R416  200  [RESC1005X40N]
R417  200  [RESC1005X40N]
R472  49R9  [RESC1005X40N]
R473  49R9  [RESC1005X40N]
R474  49R9  [RESC1005X40N]
R514  49R9  [RESC1005X40N]

### Ports
ALT_PORT0 (harness PORT0), AMC_FABRIC_CLK (harness AMC_FABRIC_CLOCK), AMC_P2P (harness P2P), CDR_CLK_CLEAN0 (harness CLK), CDR_CLK_CLEAN1 (harness CLK), CDR_CLK_CLEAN2 (harness CLK), FAT_PIPE1 (harness FAT_PIPE1), MGT_CDR_CLK (harness CLK), QSFP0 (harness QSFP), QSFP1 (harness QSFP)

### Harnesses
CLK: CLK_N, CLK_P
FAT_PIPE1: Rx4_P, Rx4_N, Tx4_N, Tx4_P, Rx5_P, Rx5_N, Tx5_N, Tx5_P, Rx6_P, Rx6_N, Tx6_N, Tx6_P, Rx7_P, Rx7_N, Tx7_N, Tx7_P
P2P: Rx12_P, Rx12_N, Tx12_N, Tx12_P, Rx13_P, Rx13_N, Tx13_N, Tx13_P, Rx14_P, Rx14_N, Tx14_N, Tx14_P, Rx15_P, Rx15_N, Tx15_N, Tx15_P
QSFP: RX0_P, RX0_N, RX1_P, RX1_N, RX2_P, RX2_N, RX3_P, RX3_N, TX0_P, TX0_N, TX1_P, TX1_N, TX2_P, TX2_N, TX3_P, TX3_N
PORT0: Rx0_P, Rx0_N, Tx0_N, Tx0_P
AMC_FABRIC_CLOCK: FCLKA_N, FCLKA_P

### Nets
GND: C623.1 C629.1 J11.2 J12.2 J21.2 J22.2 J23.2 J24.2 J25.1(GND) J25.4(GND) J25.7(GND) J26.1(GND) J26.4(GND) J26.7(GND) J27.1(GND) J27.4(GND) J27.7(GND) OSC3.3(GND) OSC4.3(GND) R414.2 R415.2 R416.2 R417.2
P3V3: L45.2 L46.2
ARX0_N: IC27.AJ3(MGTHRXN3_224) ; port ALT_PORT0.Rx0_N  [project net ALT_PORT0.Rx0_N]
ARX0_P: IC27.AJ4(MGTHRXP3_224) ; port ALT_PORT0.Rx0_P  [project net ALT_PORT0.Rx0_P]
ATX0_N: IC27.AK5(MGTHTXN3_224) ; port ALT_PORT0.Tx0_N  [project net ALT_PORT0.Tx0_N]
ATX0_P: IC27.AK6(MGTHTXP3_224) ; port ALT_PORT0.Tx0_P  [project net ALT_PORT0.Tx0_P]
CDR_CLK_CLEAN0_N: IC27.P5(MGTREFCLK0N_227) ; port CDR_CLK_CLEAN0.CLK_N  [project net CDR_CLK_CLEAN1.CLK_N]
CDR_CLK_CLEAN0_P: IC27.P6(MGTREFCLK0P_227) ; port CDR_CLK_CLEAN0.CLK_P  [project net CDR_CLK_CLEAN1.CLK_P]
CDR_CLK_CLEAN1_N: IC27.AF5(MGTREFCLK0N_224) ; port CDR_CLK_CLEAN1.CLK_N
CDR_CLK_CLEAN1_P: IC27.AF6(MGTREFCLK0P_224) ; port CDR_CLK_CLEAN1.CLK_P
CDR_CLK_CLEAN2_N: IC27.Y5(MGTREFCLK1N_225) ; port CDR_CLK_CLEAN2.CLK_N
CDR_CLK_CLEAN2_P: IC27.Y6(MGTREFCLK1P_225) ; port CDR_CLK_CLEAN2.CLK_P
CLK_200MHz_N: C715.2 R514.2
CLK_200MHz_P: C716.2 R474.2
CLK_RFU_N: C622.2 IC27.M5(MGTREFCLK1N_227)
CLK_RFU_P: C620.2 IC27.M6(MGTREFCLK1P_227)
FCLKA_N: C713.2 ; port AMC_FABRIC_CLK.FCLKA_N  [project net AMC_FABRIC_CLOCK.FCLKA_N]
FCLKA_P: C714.2 ; port AMC_FABRIC_CLK.FCLKA_P  [project net AMC_FABRIC_CLOCK.FCLKA_P]
FCLKAC_N: C713.1 C715.1 IC27.AB5(MGTREFCLK0N_225)
FCLKAC_P: C714.1 C716.1 IC27.AB6(MGTREFCLK0P_225)
GTP0RXC_N: IC27.AP1(MGTHRXN0_224) J27.5(B-)  [also labelled RX0_N]
GTP0RXC_P: IC27.AP2(MGTHRXP0_224) J27.6(B+)  [also labelled RX0_P]
GTP0TXC_N: C633.1 IC27.AN3(MGTHTXN0_224)
GTP0TXC_P: C634.1 IC27.AN4(MGTHTXP0_224)
GTP1RXC_N: IC27.AM1(MGTHRXN1_224) J26.5(B-)  [also labelled RX1_N]
GTP1RXC_P: IC27.AM2(MGTHRXP1_224) J26.6(B+)  [also labelled RX1_P]
GTP1TXC_N: C635.1 IC27.AM5(MGTHTXN1_224)
GTP1TXC_P: C636.1 IC27.AM6(MGTHTXP1_224)
GTP2RXC_N: IC27.AK1(MGTHRXN2_224) J25.5(B-)  [also labelled RX2_N]
GTP2RXC_P: IC27.AK2(MGTHRXP2_224) J25.6(B+)  [also labelled RX2_P]
GTP2TXC_N: C637.1 IC27.AL3(MGTHTXN2_224)
GTP2TXC_P: C638.1 IC27.AL4(MGTHTXP2_224)
GTP4RXC_N: IC27.F1(MGTHRXN3_227) ; port FAT_PIPE1.Rx4_N  [also labelled Rx4_N]  [project net FAT_PIPE1.Rx4_N]
GTP4RXC_P: IC27.F2(MGTHRXP3_227) ; port FAT_PIPE1.Rx4_P  [also labelled Rx4_P]  [project net FAT_PIPE1.Rx4_P]
GTP4TXC_N: C631.1 IC27.G3(MGTHTXN3_227)
GTP4TXC_P: C632.1 IC27.G4(MGTHTXP3_227)
GTP5RXC_N: IC27.H1(MGTHRXN2_227) ; port FAT_PIPE1.Rx5_N  [also labelled Rx5_N]  [project net FAT_PIPE1.Rx5_N]
GTP5RXC_P: IC27.H2(MGTHRXP2_227) ; port FAT_PIPE1.Rx5_P  [also labelled Rx5_P]  [project net FAT_PIPE1.Rx5_P]
GTP5TXC_N: C626.1 IC27.J3(MGTHTXN2_227)
GTP5TXC_P: C627.1 IC27.J4(MGTHTXP2_227)
GTP6RXC_N: IC27.K1(MGTHRXN1_227) ; port FAT_PIPE1.Rx6_N  [also labelled Rx6_N]  [project net FAT_PIPE1.Rx6_N]
GTP6RXC_P: IC27.K2(MGTHRXP1_227) ; port FAT_PIPE1.Rx6_P  [also labelled Rx6_P]  [project net FAT_PIPE1.Rx6_P]
GTP6TXC_N: C619.1 IC27.L3(MGTHTXN1_227)
GTP6TXC_P: C621.1 IC27.L4(MGTHTXP1_227)
GTP7RXC_N: IC27.M1(MGTHRXN0_227) ; port FAT_PIPE1.Rx7_N  [also labelled Rx7_N]  [project net FAT_PIPE1.Rx7_N]
GTP7RXC_P: IC27.M2(MGTHRXP0_227) ; port FAT_PIPE1.Rx7_P  [also labelled Rx7_P]  [project net FAT_PIPE1.Rx7_P]
GTP7TXC_N: C615.1 IC27.N3(MGTHTXN0_227)
GTP7TXC_P: C616.1 IC27.N4(MGTHTXP0_227)
GTP12RXC_N: IC27.AB1(MGTHRXN3_225) ; port AMC_P2P.Rx12_P  [also labelled Rx12_N]  [project net AMC_P2P.Rx12_P]
GTP12RXC_P: IC27.AB2(MGTHRXP3_225) ; port AMC_P2P.Rx12_N  [also labelled Rx12_P]  [project net AMC_P2P.Rx12_N]
GTP12TXC_N: C628.2 IC27.AC3(MGTHTXN3_225)
GTP12TXC_P: C630.2 IC27.AC4(MGTHTXP3_225)
GTP13RXC_N: IC27.AD1(MGTHRXN2_225) ; port AMC_P2P.Rx13_P  [also labelled Rx13_N]  [project net AMC_P2P.Rx13_P]
GTP13RXC_P: IC27.AD2(MGTHRXP2_225) ; port AMC_P2P.Rx13_N  [also labelled Rx13_P]  [project net AMC_P2P.Rx13_N]
GTP13TXC_N: C624.2 IC27.AE3(MGTHTXN2_225)
GTP13TXC_P: C625.2 IC27.AE4(MGTHTXP2_225)
GTP14RXC_N: IC27.AF1(MGTHRXN1_225) ; port AMC_P2P.Rx14_P  [also labelled Rx14_N]  [project net AMC_P2P.Rx14_P]
GTP14RXC_P: IC27.AF2(MGTHRXP1_225) ; port AMC_P2P.Rx14_N  [also labelled Rx14_P]  [project net AMC_P2P.Rx14_N]
GTP14TXC_N: C617.2 IC27.AG3(MGTHTXN1_225)
GTP14TXC_P: C618.2 IC27.AG4(MGTHTXP1_225)
GTP15RXC_N: IC27.AH1(MGTHRXN0_225) ; port AMC_P2P.Rx15_P  [also labelled Rx15_N]  [project net AMC_P2P.Rx15_P]
GTP15RXC_P: IC27.AH2(MGTHRXP0_225) ; port AMC_P2P.Rx15_N  [also labelled Rx15_P]  [project net AMC_P2P.Rx15_N]
GTP15TXC_N: C613.2 IC27.AH5(MGTHTXN0_225)
GTP15TXC_P: C614.2 IC27.AH6(MGTHTXP0_225)
MGT_CDR_CLK_N: IC27.AD5(MGTREFCLK1N_224) ; port MGT_CDR_CLK.CLK_N
MGT_CDR_CLK_P: IC27.AD6(MGTREFCLK1P_224) ; port MGT_CDR_CLK.CLK_P
OSC1_PWR: C629.2 L46.1 OSC4.2(OE) OSC4.6(VDD)
OSC2_PWR: C623.2 L45.1 OSC3.2(OE) OSC3.6(VDD)
QSFPRX0_N: IC27.P1(MGTHRXN3_226) ; port QSFP0.RX0_N  [project net QSFP0.RX0_N]
QSFPRX0_P: IC27.P2(MGTHRXP3_226) ; port QSFP0.RX0_P  [project net QSFP0.RX0_P]
QSFPRX1_N: IC27.T1(MGTHRXN2_226) ; port QSFP0.RX1_N  [project net QSFP0.RX1_N]
QSFPRX1_P: IC27.T2(MGTHRXP2_226) ; port QSFP0.RX1_P  [project net QSFP0.RX1_P]
QSFPRX2_N: IC27.V1(MGTHRXN1_226) ; port QSFP0.RX2_N  [project net QSFP0.RX2_N]
QSFPRX2_P: IC27.V2(MGTHRXP1_226) ; port QSFP0.RX2_P  [project net QSFP0.RX2_P]
QSFPRX3_N: IC27.Y1(MGTHRXN0_226) ; port QSFP0.RX3_N  [project net QSFP0.RX3_N]
QSFPRX3_P: IC27.Y2(MGTHRXP0_226) ; port QSFP0.RX3_P  [project net QSFP0.RX3_P]
QSFPRX4_N: IC27.A3(MGTHRXN3_228) ; port QSFP1.RX0_N  [project net QSFP1.RX0_N]
QSFPRX4_P: IC27.A4(MGTHRXP3_228) ; port QSFP1.RX0_P  [project net QSFP1.RX0_P]
QSFPRX5_N: IC27.B1(MGTHRXN2_228) ; port QSFP1.RX1_N  [project net QSFP1.RX1_N]
QSFPRX5_P: IC27.B2(MGTHRXP2_228) ; port QSFP1.RX1_P  [project net QSFP1.RX1_P]
QSFPRX6_N: IC27.D1(MGTHRXN1_228) ; port QSFP1.RX2_N  [project net QSFP1.RX2_N]
QSFPRX6_P: IC27.D2(MGTHRXP1_228) ; port QSFP1.RX2_P  [project net QSFP1.RX2_P]
QSFPRX7_N: IC27.E3(MGTHRXN0_228) ; port QSFP1.RX3_N  [project net QSFP1.RX3_N]
QSFPRX7_P: IC27.E4(MGTHRXP0_228) ; port QSFP1.RX3_P  [project net QSFP1.RX3_P]
QSFPTX0_N: IC27.R3(MGTHTXN3_226) ; port QSFP0.TX0_N  [project net QSFP0.TX0_N]
QSFPTX0_P: IC27.R4(MGTHTXP3_226) ; port QSFP0.TX0_P  [project net QSFP0.TX0_P]
QSFPTX1_N: IC27.U3(MGTHTXN2_226) ; port QSFP0.TX1_N  [project net QSFP0.TX1_N]
QSFPTX1_P: IC27.U4(MGTHTXP2_226) ; port QSFP0.TX1_P  [project net QSFP0.TX1_P]
QSFPTX2_N: IC27.W3(MGTHTXN1_226) ; port QSFP0.TX2_N  [project net QSFP0.TX2_N]
QSFPTX2_P: IC27.W4(MGTHTXP1_226) ; port QSFP0.TX2_P  [project net QSFP0.TX2_P]
QSFPTX3_N: IC27.AA3(MGTHTXN0_226) ; port QSFP0.TX3_N  [project net QSFP0.TX3_N]
QSFPTX3_P: IC27.AA4(MGTHTXP0_226) ; port QSFP0.TX3_P  [project net QSFP0.TX3_P]
QSFPTX4_N: IC27.B5(MGTHTXN3_228) ; port QSFP1.TX0_N  [project net QSFP1.TX0_N]
QSFPTX4_P: IC27.B6(MGTHTXP3_228) ; port QSFP1.TX0_P  [project net QSFP1.TX0_P]
QSFPTX5_N: IC27.C3(MGTHTXN2_228) ; port QSFP1.TX1_N  [project net QSFP1.TX1_N]
QSFPTX5_P: IC27.C4(MGTHTXP2_228) ; port QSFP1.TX1_P  [project net QSFP1.TX1_P]
QSFPTX6_N: IC27.D5(MGTHTXN1_228) ; port QSFP1.TX2_N  [project net QSFP1.TX2_N]
QSFPTX6_P: IC27.D6(MGTHTXP1_228) ; port QSFP1.TX2_P  [project net QSFP1.TX2_P]
QSFPTX7_N: IC27.F5(MGTHTXN0_228) ; port QSFP1.TX3_N  [project net QSFP1.TX3_N]
QSFPTX7_P: IC27.F6(MGTHTXP0_228) ; port QSFP1.TX3_P  [project net QSFP1.TX3_P]
REFCLK226_UFL_N: C712.1 IC27.T5(MGTREFCLK1N_226)
REFCLK226_UFL_P: C711.1 IC27.T6(MGTREFCLK1P_226)
REFCLK228_C_N: C610.1 IC27.K5(MGTREFCLK0N_228)
REFCLK228_C_P: C609.1 IC27.K6(MGTREFCLK0P_228)
REFCLK228_UFL_N: C611.1 IC27.H5(MGTREFCLK1N_228)
REFCLK228_UFL_P: C612.1 IC27.H6(MGTREFCLK1P_228)
TX0_N: C633.2 J27.3(A-)
TX0_P: C634.2 J27.2(A+)
TX1_N: C635.2 J26.3(A-)
TX1_P: C636.2 J26.2(A+)
TX2_N: C637.2 J25.3(A-)
TX2_P: C638.2 J25.2(A+)
Tx4_N: C631.2 ; port FAT_PIPE1.Tx4_N  [project net FAT_PIPE1.Tx4_N]
Tx4_P: C632.2 ; port FAT_PIPE1.Tx4_P  [project net FAT_PIPE1.Tx4_P]
Tx5_N: C626.2 ; port FAT_PIPE1.Tx5_N  [project net FAT_PIPE1.Tx5_N]
Tx5_P: C627.2 ; port FAT_PIPE1.Tx5_P  [project net FAT_PIPE1.Tx5_P]
Tx6_N: C619.2 ; port FAT_PIPE1.Tx6_N  [project net FAT_PIPE1.Tx6_N]
Tx6_P: C621.2 ; port FAT_PIPE1.Tx6_P  [project net FAT_PIPE1.Tx6_P]
Tx7_N: C615.2 ; port FAT_PIPE1.Tx7_N  [project net FAT_PIPE1.Tx7_N]
Tx7_P: C616.2 ; port FAT_PIPE1.Tx7_P  [project net FAT_PIPE1.Tx7_P]
Tx12_N: C628.1 ; port AMC_P2P.Tx12_N  [project net AMC_P2P.Tx12_N]
Tx12_P: C630.1 ; port AMC_P2P.Tx12_P  [project net AMC_P2P.Tx12_P]
Tx13_N: C624.1 ; port AMC_P2P.Tx13_N  [project net AMC_P2P.Tx13_N]
Tx13_P: C625.1 ; port AMC_P2P.Tx13_P  [project net AMC_P2P.Tx13_P]
Tx14_N: C617.1 ; port AMC_P2P.Tx14_N  [project net AMC_P2P.Tx14_N]
Tx14_P: C618.1 ; port AMC_P2P.Tx14_P  [project net AMC_P2P.Tx14_P]
Tx15_N: C613.1 ; port AMC_P2P.Tx15_N  [project net AMC_P2P.Tx15_N]
Tx15_P: C614.1 ; port AMC_P2P.Tx15_P  [project net AMC_P2P.Tx15_P]
NetC609_2: C609.2 J21.1
NetC610_2: C610.2 J22.1
NetC611_2: C611.2 J23.1
NetC612_2: C612.2 J24.1
NetC620_1: C620.1 R472.2
NetC622_1: C622.1 R473.2
NetC711_2: C711.2 J11.1
NetC712_2: C712.2 J12.1
NetOSC3_4: OSC3.4(CLK+) R414.1 R472.1
NetOSC3_5: OSC3.5(CLK-) R415.1 R473.1
NetOSC4_4: OSC4.4(CLK+) R416.1 R474.1
NetOSC4_5: OSC4.5(CLK-) R417.1 R514.1

Not connected (* = marked no-connect by the designer): IC27 V5(MGTREFCLK0N_226)* V6(MGTREFCLK0P_226)*; OSC3 1(NC)*; OSC4 1(NC)*

### Layout directives
differential pair; differential pair class Diff_100Ohm: ALT_PORT0.Rx0_N, ALT_PORT0.Rx0_P, ALT_PORT0.Tx0_N, ALT_PORT0.Tx0_P, AMC_P2P.Rx12_N, AMC_P2P.Rx12_P, AMC_P2P.Rx13_N, AMC_P2P.Rx13_P, AMC_P2P.Rx14_N, AMC_P2P.Rx14_P, AMC_P2P.Rx15_N, AMC_P2P.Rx15_P, AMC_P2P.Tx12_N, AMC_P2P.Tx12_P, AMC_P2P.Tx13_N, AMC_P2P.Tx13_P, AMC_P2P.Tx14_N, AMC_P2P.Tx14_P, AMC_P2P.Tx15_N, AMC_P2P.Tx15_P, CDR_CLK_CLEAN1.CLK_N, CDR_CLK_CLEAN1.CLK_P, CDR_CLK_CLEAN1_N, CDR_CLK_CLEAN1_P, CDR_CLK_CLEAN2_N, CDR_CLK_CLEAN2_P, FAT_PIPE1.Rx4_N, FAT_PIPE1.Rx4_P, FAT_PIPE1.Rx5_N, FAT_PIPE1.Rx5_P, FAT_PIPE1.Rx6_N, FAT_PIPE1.Rx6_P, FAT_PIPE1.Rx7_N, FAT_PIPE1.Rx7_P, FAT_PIPE1.Tx4_N, FAT_PIPE1.Tx4_P, FAT_PIPE1.Tx5_N, FAT_PIPE1.Tx5_P, FAT_PIPE1.Tx6_N, FAT_PIPE1.Tx6_P, FAT_PIPE1.Tx7_N, FAT_PIPE1.Tx7_P, FCLKAC_N, FCLKAC_P, GTP0RXC_N, GTP0RXC_P, GTP0TXC_N, GTP0TXC_P, GTP1RXC_N, GTP1RXC_P, GTP1TXC_N, GTP1TXC_P, GTP2RXC_N, GTP2RXC_P, GTP2TXC_N, GTP2TXC_P, MGT_CDR_CLK_N, MGT_CDR_CLK_P, QSFP0.RX0_N, QSFP0.RX0_P, QSFP0.RX1_N, QSFP0.RX1_P, QSFP0.RX2_N, QSFP0.RX2_P, QSFP0.RX3_N, QSFP0.RX3_P, QSFP0.TX0_N, QSFP0.TX0_P, QSFP0.TX1_N, QSFP0.TX1_P, QSFP0.TX2_N, QSFP0.TX2_P, QSFP0.TX3_N, QSFP0.TX3_P, QSFP1.RX0_N, QSFP1.RX0_P, QSFP1.RX1_N, QSFP1.RX1_P, QSFP1.RX2_N, QSFP1.RX2_P, QSFP1.RX3_N, QSFP1.RX3_P, QSFP1.TX0_N, QSFP1.TX0_P, QSFP1.TX1_N, QSFP1.TX1_P, QSFP1.TX2_N, QSFP1.TX2_P, QSFP1.TX3_N, QSFP1.TX3_P, REFCLK226_UFL_N, REFCLK226_UFL_P, REFCLK228_UFL_N, REFCLK228_UFL_P, TX0_N, TX0_P, TX1_N, TX1_P, TX2_N, TX2_P
differential pair; differential pair class LVPECL: CLK_200MHz_N, CLK_200MHz_P, CLK_RFU_N, CLK_RFU_P

### Notes on the sheet
- QSFP0
- (near IC27) QSFP1
- Rx4
- Tx4
- Rx5
- P2P
- Tx6
- Tx5
- Rx6
- FATPIPE1
- Tx7
- Rx7
- 3 x SATA
- Copyright ISE WUT 2016.
- Default NOT connected to PORT0 in ETH_PHY_RMII.SchDoc
- redistribute and modify this documentation under the
- distributed WITHOUT ANY EXPRESS OR IMPLIED
- licensed under the CERN OHL v.1.2. You may
- (http://ohwr.org/CERNOHL). This documentation is
- terms of the CERN OHL v.1.2.
- This documentation describes Open Hardware and is
- conditions.
- Please see the CERN OHL v.1.2 for applicable
- AND FITNESS FOR A PARTICULAR PURPOSE.
- WARRANTY, INCLUDING OF
- MERCHANTABILITY, SATISFACTORY QUALITY
- Project/Equipment
- Document
- Designer
- Drawn by
- Check.by
- File
- Last Mod.
- Print Date
- Sheet
- Size
- A3
- of
- Rev
- (in symbol R0402_49R9_1%_0.0625W_100PPM) 1%
- (in symbol R0402_200R_1%_0.0625W_100PPM) 1%

### Library data of the parts
C609-C638 C711-C716 = CC0201_100NF_6.3V_10%_X5R: as C596-C606 on sheet FPGA_Bank_0_CFG; Manufacturer Part Number: CC0201_100NF_6.3V_10%_X5R; Part Number: CC0201_100NF_6.3V_10%_X5R; Value: 100nF; Component Kind: Standard; Component Type: Standard; Pin Count: 2; Status: Not Recommended; Case: 0201; Mounted: Yes; Socket: No; SMD: Yes; Sense: No; Manufacturer1 Example: AVX; Manufacturer1 ComponentHeight: 0.33mm; HelpURL: \\cern.ch\dfs\Applications\Altium\Datasheets\CC0201_X5R_AVX.pdf; Author: CERN DEM JLC; CreateDate: 03.12.2007; LatestRevisionDate: 03.12.2007
IC27 = XCKU040-1FFVA1156C: as IC27 on sheet FPGA_Bank_0_CFG; Manufacturer Part Number: XCKU040-1FFVA1156C; PackageDescription: BGA, 1.00mm Pitch, Square; 1156 Pin, 34 Columns X 34 Rows, Body 35.00mm X 35.00mm X 3.50mm H, IPC Medium Density; Part Number: XCKU040-1FFVA1156C; Component Kind: Standard; Component Type: Standard; Device: XCKU040-1FFVA1156C; Pin Count: 1156; Case: BGA1156; Mounted: Yes; Socket: No; SMD: Yes; Sense: No; ComponentHeight: 3.5mm; HelpURL: \\cern.ch\dfs\Applications\Altium\Datasheets\XCKU040-1FFVA1156C.pdf; ComponentLink1URL: \\cern.ch\dfs\Applications\Altium\Datasheets\XCKU040-1FFVA1156C_Package-Pinout.pdf; ComponentLink1Description: Package/Pinout; Author: CERN DEM CA; CreateDate: 16.08.2016; LatestRevisionDate: 16.08.2016
J11 J12 J21-J24 = HIROSE_U.FL-R-SMT-1(10): Manufacturer: HIROSE (HRS); Part Description: Up to 6GHz Ultra Small Surface Mount Male Coaxial Connectors U.FL Series; PressFit: No; Manufacturer Part Number: U.FL-R-SMT-1(10); Part Number: HIROSE_U.FL-R-SMT-1(10); Component Kind: Standard; Component Type: Standard; Pin Count: 2; Family: U.FL; Mounted: Yes; Socket: No; SMD: Yes; Sense: No; Status: None; ComponentHeight: 1.25mm; HelpURL: \\cern.ch\dfs\Applications\Altium\Datasheets\HIROSE_U.FL-R-SMT-1(10).pdf; Author: CERN DEM JLC; CreateDate: 24.03.2010; LatestRevisionDate: 24.03.2010
J25-J27 = MOLEX_67800-5005: 7 Pin SATA Receptacle; Manufacturer: MOLEX; Part Description: 1.27mm Pitch, 7 Contacts, Serial ATA High Speed Header, Straight with Locking Latch; PressFit: No; Manufacturer Part Number: 67800-5005; Part Number: MOLEX_67800-5005; Component Kind: Standard; Component Type: Standard; Pin Count: 7; Family: SATA; Mounted: Yes; Socket: No; SMD: Yes; Sense: No; Status: None; ComponentHeight: 8.4mm; HelpURL: \\cern.ch\dfs\Applications\Altium\Datasheets\MOLEX_67800-5005.pdf; Author: CERN DEM MR; CreateDate: 01.12.2016; LatestRevisionDate: 01.12.2016
L45 L46 = IND0402_MURATA_BLM15PX121SN1D: Inductor; Manufacturer: MURATA; Part Description: SMD EMIFIL Chip Ferrite Bead; Tolerance: ±25%; Power: 2A; Resistance: 0.055R; Manufacturer Part Number: BLM15PX121SN1D; Part Number: IND0402_MURATA_BLM15PX121SN1D; Value: 120R@100MHz; Component Kind: Standard; Component Type: Standard; Pin Count: 2; Status: None; Case: 0402; Mounted: Yes; Socket: No; SMD: Yes; Sense: No; ComponentHeight: 0.55mm; HelpURL: \\cern.ch\dfs\Applications\Altium\Datasheets\IND0402_MURATA_BLM15PX.pdf; Author: CERN DEM JMW; CreateDate: 19.02.2014; LatestRevisionDate: 19.02.2014
OSC3 OSC4 = OSC_200MHZ_SILICON-LAB_510ABA200M000AAG: Crystal Oscillator 6 pins, Si510 (LVDS/LVPECL/HCSL/Dual CMOS); Part Description: 3.3V ±25ppm LVPECL Crystal Oscillator (XO), Si510 Series; Manufacturer: SILICON LABS; Autho: T.P.; PressFit: No; Bonding: No; Manufacturer Part Number: 510ABA200M000AAG; Mounted: Yes; PackageDescription: Oscillator Si510 Series, 6 pins, 5x7mm; Part Number: OSC_200MHZ_SILICON-LAB_510ABA200M000AAG; Pin Count: 6; Sense: No; Component Kind: Standard; Component Type: Standard; ComponentHeight: 1.8mm; CreateDate: 22.01.2019; SMD: Yes; Value: 200MHz; Socket: No
R414-R417 = R0402_200R_1%_0.0625W_100PPM: as R379 on sheet FPGA_Bank_0_CFG; Manufacturer Part Number: R0402_200R_1%_0.0625W_100PPM; Part Number: R0402_200R_1%_0.0625W_100PPM; Tolerance: ±1%; Value: 200; Component Kind: Standard; Component Type: Standard; Pin Count: 2; Status: Not Recommended; Power: 0.0625W; Case: 0402; Mounted: Yes; Sense: No; Socket: No; SMD: Yes; Manufacturer1 Example: YAGEO PHYCOMP; Manufacturer1 ComponentHeight: 0.4mm; HelpURL: \\cern.ch\dfs\Applications\Altium\Datasheets\R0402_Phycomp_RC0402.pdf; Author: CERN DEM JLC; CreateDate: 03.12.2007; LatestRevisionDate: 17.10.2012
R472-R474 R514 = R0402_49R9_1%_0.0625W_100PPM: as R495-R499 on sheet FPGA_Bank_0_CFG; Manufacturer Part Number: R0402_49R9_1%_0.0625W_100PPM; Part Number: R0402_49R9_1%_0.0625W_100PPM; Tolerance: ±1%; Value: 49R9; Component Kind: Standard; Component Type: Standard; Pin Count: 2; Status: Not Recommended; Power: 0.0625W; Case: 0402; Mounted: Yes; Sense: No; Socket: No; SMD: Yes; Manufacturer1 Example: YAGEO PHYCOMP; Manufacturer1 ComponentHeight: 0.4mm; HelpURL: \\cern.ch\dfs\Applications\Altium\Datasheets\R0402_Phycomp_RC0402.pdf; Author: CERN DEM JLC; CreateDate: 24.10.2012; LatestRevisionDate: 24.10.2012